# Altium project MiniPC.PrjPcb (part 7 of 10)

## Sheet 12V_POWER.SchDoc: 12V Power PMOS Switches
size B; DocumentNumber: 34; SheetNumber: 34; SheetTotal: 46
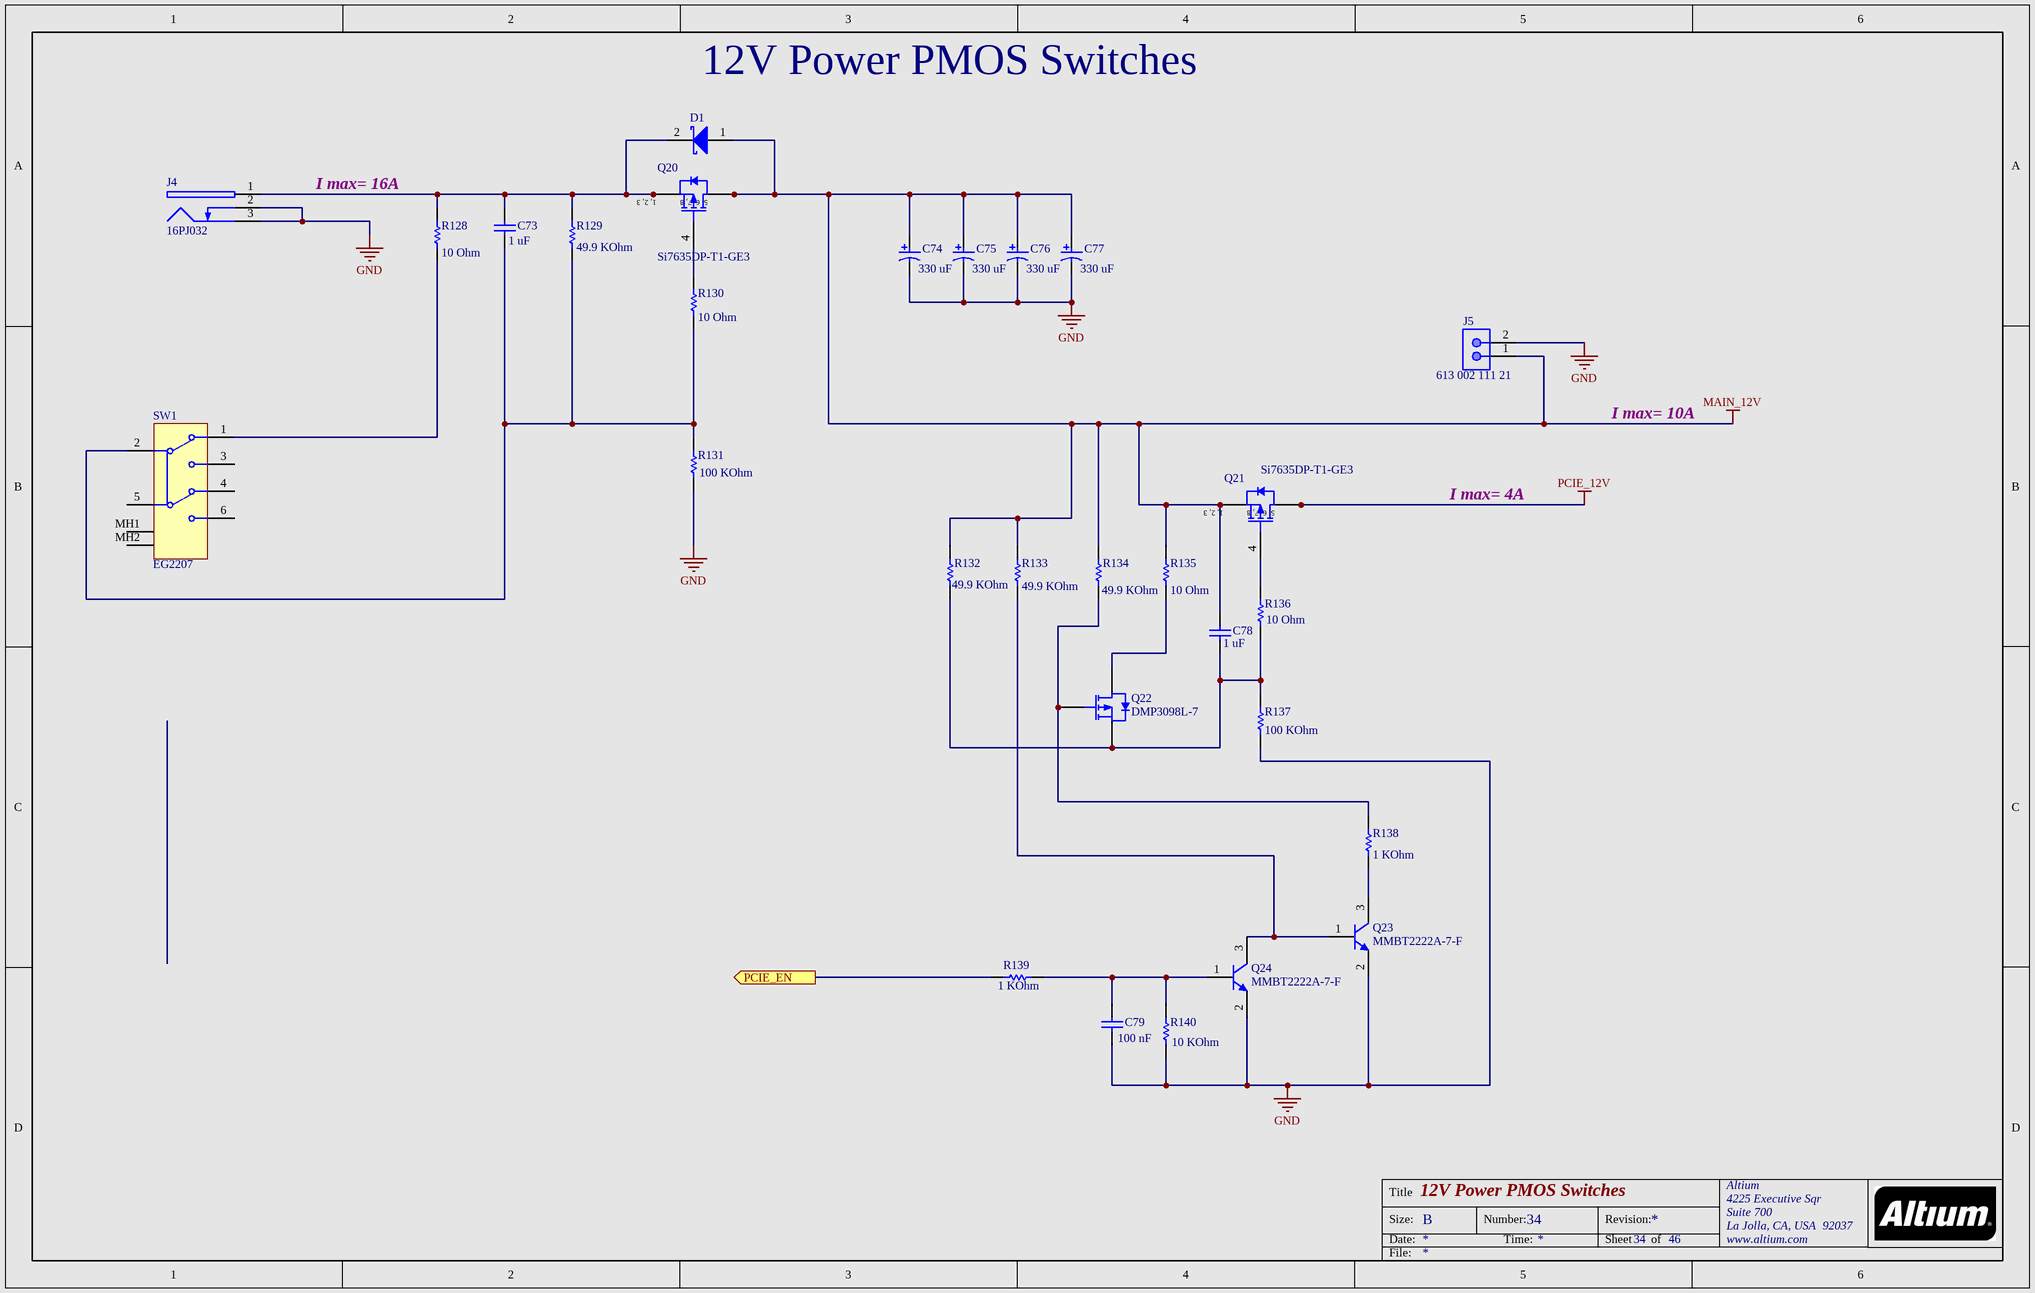
[diagram p22: 12V_POWER.SchDoc]

### Parts
C73  Capacitance: 1 uF  [CAPC1005X33X10LL5]  (hidden comment: CGB2A1X5R1E105K033BC)
C74  Capacitance: 330 uF  [PNSC-EEH-ZA1E331P_M]  (hidden comment: EEH-ZA1E331P)
C75  Capacitance: 330 uF  [PNSC-EEH-ZA1E331P_M]  (hidden comment: EEH-ZA1E331P)
C76  Capacitance: 330 uF  [PNSC-EEH-ZA1E331P_M]  (hidden comment: EEH-ZA1E331P)
C77  Capacitance: 330 uF  [PNSC-EEH-ZA1E331P_M]  (hidden comment: EEH-ZA1E331P)
C78  Capacitance: 1 uF  [CAPC1005X33X10LL5]  (hidden comment: CGB2A1X5R1E105K033BC)
C79  Capacitance: 100 nF  [CAPC1005X55X10LL05]  (hidden comment: C1005X7R1E104M)
D1  B530C-13-F  [DIOD-SMC-2_V]  (value not drawn)
J4  16PJ032  [KOBI-16PJ032_V]
J5  613 002 111 21  [WE-61300211121_V]
Q20  Si7635DP-T1-GE3  [VISH-PPAKSO-8_V]
Q21  Si7635DP-T1-GE3  [VISH-PPAKSO-8_V]
Q22  DMP3098L-7  [DIOD-SOT23-3_V]
Q23  MMBT2222A-7-F  [DIOD-SOT23-3_V]
Q24  MMBT2222A-7-F  [DIOD-SOT23-3_V]
R128  Resistance: 10 Ohm  [RESC1005X40X25LL05T05]  (hidden comment: ERJ-2RKF10R0X)
R129  Resistance: 49.9 KOhm  [RESC1005X40X25LL05T05]  (hidden comment: ERJ-2RKF4992X)
R130  Resistance: 10 Ohm  [RESC1005X40X25LL05T05]  (hidden comment: ERJ-2RKF10R0X)
R131  Resistance: 100 KOhm  [RESC1005X40X25LL05T05]  (hidden comment: ERJ-2RKF1003X)
R132  Resistance: 49.9 KOhm  [RESC1005X40X25LL05T05]  (hidden comment: ERJ-2RKF4992X)
R133  Resistance: 49.9 KOhm  [RESC1005X40X25LL05T05]  (hidden comment: ERJ-2RKF4992X)
R134  Resistance: 49.9 KOhm  [RESC1005X40X25LL05T05]  (hidden comment: ERJ-2RKF4992X)
R135  Resistance: 10 Ohm  [RESC1005X40X25LL05T05]  (hidden comment: ERJ-2RKF10R0X)
R136  Resistance: 10 Ohm  [RESC1005X40X25LL05T05]  (hidden comment: ERJ-2RKF10R0X)
R137  Resistance: 100 KOhm  [RESC1005X40X25LL05T05]  (hidden comment: ERJ-2RKF1003X)
R138  Resistance: 1 KOhm  [RESC1005X40X25LL05T05]  (hidden comment: ERJ-2RKF1001X)
R139  Resistance: 1 KOhm  [RESC1005X40X25LL05T05]  (hidden comment: ERJ-2RKF1001X)
R140  Resistance: 10 KOhm  [RESC1005X40X25NL05T05]  (hidden comment: ERJ-2RKF1002X)
SW1  EG2207  [ESWI-EG2207_V]

### Ports
PCIE_EN (out)

### Nets
GND: C74.2 C75.2 C76.2 C77.2 C79.1 J4.2 J4.3 J5.2 Q23.2(E) Q24.2(E) R131.1 R137.1 R140.1
MAIN_12V: C74.1 C75.1 C76.1 C77.1 C78.2 D1.1(A) J5.1 Q20.5(D) Q20.6(D) Q20.7(D) Q20.8(D) Q21.1(S) Q21.2(S) Q21.3(S) R132.2 R133.2 R134.2 R135.2
PCIE_12V: Q21.5(D) Q21.6(D) Q21.7(D) Q21.8(D)
PCIE_EN: R139.1 ; port PCIE_EN
NetC73_1: C73.1 R129.1 R130.1 R131.2 SW1.2
NetC73_2: C73.2 D1.2(K) J4.1 Q20.1(S) Q20.2(S) Q20.3(S) R128.2 R129.2
NetC78_1: C78.1 Q22.2(S) R132.1 R136.1 R137.2
NetC79_2: C79.2 Q24.1(B) R139.2 R140.2
NetQ20_4: Q20.4(G) R130.2
NetQ21_4: Q21.4(G) R136.2
NetQ22_1: Q22.1(G) R134.1 R138.2
NetQ22_3: Q22.3(D) R135.1
NetQ23_1: Q23.1(B) Q24.3(C) R133.1
NetQ23_3: Q23.3(C) R138.1
NetR128_1: R128.1 SW1.1

Not connected (* = marked no-connect by the designer): SW1 3 4 5 6 MH1 MH2

### Notes on the sheet
- (near R128) I max= 16A
- I max= 10A
- I max= 4A
- Title
- Size:
- Date:
- B
- Number:
- Time:
- Revision:
- Sheet
- of
- File:
- (in symbol CMP-1709-00003-3) 1, 2, 3; 5, 6, 7, 8

### Library data of the parts
C73 C78 = CMP-1663-00006-2: Chip Capacitor, 1 uF, +/- 10%, 25 V, -55 to 85 degC, 0402 (1005 Metric), RoHS, Tape and Reel; Tolerance: 10%; PackageDescription: 2-Pin Surface Mount Device, Body 1 x 0.5 mm; PartNumber: CGB2A1X5R1E105K033BC; Case Code (Metric): 1005; DatasheetVersion: 04/2015; RoHSCompliant: True; Max Operating Temperature: 85 degC; ComponentLink2URL: https://product.tdk.com/info/en/catalog/datasheets/mlcc_commercial_lowprofile_en.pdf; Package Quantity: 1; Width: 0.02 inch; Case/Package: 0402; Case Code (Imperial): 0402; Packaging: Tape and Reel; Length: 0.039 inch; Min Operating Temperature: -55 degC; Mounting Technology: Surface Mount; ComponentLink2Description: Datasheet; ComponentLink1URL: http://www.tdk.com/; ComponentLink1Description: Manufacturer URL
C74-C77 = CMP-1665-00032-1: Aluminum Electrolytic Capacitor, 330 uF, +/- 20%, 25 V, -55 to 105 degC, 2-Pin CAPAE, RoHS, Tape and Reel; Voltage Rating (DC): 25 V; Case\/Package: G; Radiation Hardening: No; DatasheetVersion: 10/2014; ComponentLink1URL: http://www.panasonic.com/; Min Operating Temperature: -55 degC; RoHSCompliant: true; ComponentLink1Description: Manufacturer URL; ComponentLink2Description: Datasheet; Package Quantity: 500; Max Operating Temperature: 105 degC; Mounting Technology: Surface Mount; Mount: Surface Mount; Packaging: Tape and Reel; Tolerance: 20%; Voltage Rating: 25 V; PackageDescription: 2-Pin Aluminum Electrolytic Capacitor, Body 10.2 x 10.2 mm, Diameter 10 mm; PackageReference: EEH-ZA1E331P; REACH SVHC: Unknown; ComponentLink2URL: https://datasheet.ciiva.com/25613/0900766b81233638-25613835.pdf; Length: 10.2 mm; Height: 10.5 mm
C79 = CMP-1663-00009-2: as C483 on sheet PCIE_Connector; Tolerance: 20%; Mounting Technology: Surface Mount; Max Operating Temperature: 125 degC; ComponentLink2URL: http://www.farnell.com/datasheets/1571323.pdf; ComponentLink1URL: http://www.tdk.com/; RoHSCompliant: true; Packaging: Tape and Reel; ComponentLink2Description: Datasheet; Case Code (Imperial): 0402; DatasheetVersion: 09/2011; ComponentLink1Description: Manufacturer URL; PackageDescription: 2-Pin Surface Mount Device, Body 1 x 0.5 mm; PackageReference: 0402; Min Operating Temperature: -55 degC; Case Code (Metric): 1005; Height: 0.5 mm; Package Quantity: 10000; Width: 0.5 mm; Pins: 2; Voltage Rating (DC): 25 V; PartNumber: C1005X7R1E104M; Mount: Surface Mount; Length: 1 mm
D1 = CMP-1693-00001-1: Surface Mount Schottky Barrier Rectifier, 5 A, 0.55 V, -55 to 150 degC, 2-Pin SMD, RoHS, Tape and Reel; Manufacturer: Diodes Inc; PackageReference: SMC-2; Mounting Technology: Surface Mount; DatasheetVersion: Rev. 16-2; ComponentLink2URL: http://www.diodes.com/_files/datasheets/ds13012.pdf; ComponentLink1Description: Manufacturer URL; ComponentLink1URL: http://www.diodes.com/; ComponentLink2Description: Datasheet; PartNumber: B530C-13-F; PackageDescription: 2-Pin Surface Mount Device, Body 5.905 x 6.855 mm
J4 = CMP-1737-00001-1: DC Power Jack, Female, -10 to 70 degC, 3-Pin THD, RoHS; Voltage Rating: 16 V; Current Rating: 1 A; Connector Type: Power; ComponentLink2URL: https://datasheet.ciiva.com/12342/kc-300037-195479-12342832.pdf; Min Operating Temperature: -10 degC; Gender: Female; Package Quantity: 100; PartNumber: 16PJ032; ComponentLink1Description: Manufacturer URL; DatasheetVersion: 05/2009; Mounting Technology: Through Hole; ComponentLink1URL: http://kobiconn.industrialpartner.com/; PackageDescription: 3-Pin Through Hole Device, Body 8.9916 x 13.4874 mm; ComponentLink2Description: Datasheet; RoHSCompliant: false; Max Operating Temperature: 70 degC
J5 = CMP-1712-00002-1: as J18 on sheet PLL; DatasheetVersion: Rev. J; ComponentLink1Description: Manufacturer URL; ComponentLink2URL: http://katalog.we-online.de/em/datasheet/6130xx11121.pdf; PackageReference: 61300211121; ComponentLink2Description: Datasheet; Mounting Technology: Through Hole; PackageDescription: Male Header, Pitch 2.54 mm, 1 x 2 Position, Height 8.54 mm, Tail Length 3 mm; ComponentLink1URL: https://www.we-online.com/; PartNumber: 613 002 111 21
Q20 Q21 = CMP-1709-00003-3: P-Channel MOSFET, 20 V, -55 to 150 degC, 8-Pin SMD (PPAKSO-8), RoHS, Tape and Reel; PartNumber: Si7635DP-T1-GE3; ComponentLink2URL: http://www.vishay.com/docs/65021/si7635dp.pdf; ComponentLink2Description: Datasheet; ComponentLink1URL: http://www.vishay.com/; Mounting Technology: Surface Mount; DatasheetVersion: Rev. B; PackageDescription: 8-Pin Surface Mount Device, Body 4.9 x 5.89 mm, Pitch 1.27 mm; ComponentLink1Description: Manufacturer URL
Q22 = CMP-0697-00001-2: P-Channel Enhancement Mode MOSFET, -30 V VDS, -55 to 155 degC, 3-Pin SOT23, RoHS, Tape and Reel; Manufacturer: Diodes Inc; RDS(on) (Max.) (VGS: 4.5 V)=120 mOhm; VGS(th) (Max.): -2.1 V; PD (TA: 25 degC)=1.08 W; VGS: +/- 20 V; IDS (TA: 25 degC)=-3.8 A; VDS: -30 V; ComponentLink3URL: http://www.diodes.com/datasheets/ap02002.pdf; Operating Temperature Range: -55 to 150 degC; Packing: Tape and Reel; ComponentLink2Description: Datasheet; PackageVersion: Rev. 75; ComponentLink1URL: http://www.diodes.com/; RoHS: TRUE; DatasheetVersion: Rev. 8 - 2; PackageDescription: 3-Pin Small Outline Transistor, Body 1.3 x 2.9 mm, Pitch 0.95 mm; ComponentLink2URL: http://www.diodes.com/datasheets/ds31447.pdf; PackageReference: SOT23; ComponentLink3Description: Package Specification; PartNumber: DMP3098L-7; ComponentLink1Description: Manufacturer URL; Mounting Technology: Surface Mount
Q23 Q24 = CMP-1693-00003-1: NPN Small Signal Transistor, 40 V, -55 to 150 degC, 3-Pin SOT23, RoHS, Tape and Reel; Manufacturer: Diodes Inc; ComponentLink1URL: http://www.diodes.com/; ComponentLink2Description: Datasheet; PackageReference: SOT23-3; PartNumber: MMBT2222A-7-F; ComponentLink1Description: Manufacturer URL; ComponentLink2URL: http://www.diodes.com/_files/datasheets/ds30041.pdf; PackageDescription: 3-Pin Small Outline Transistor, Body 2.9 x 1.3 mm, Pitch 0.95 mm; DatasheetVersion: Rev. 16 - 2; Mounting Technology: Surface Mount
R128 R130 R135 R136 = CMP-2002-00622-3: Chip Resistor, 10 Ohm, +/- 1%, 100 mW, -55 to 155 degC, 0402 (1005 Metric), RoHS, Tape and Reel; Manufacturer: Basic Passives; Voltage Rating: 50 V; Power Rating: 100 mW; Case\/Package: 0402; RoHSCompliant: true; PartNumber: ERJ-2RKF10R0X; Case Code (Imperial): 0402; Package Quantity: 10000; ComponentLink1Description: Manufacturer URL; Width: 0.5 mm; Height: 0.35 mm; Tolerance: 1%; REACH SVHC: Yes; Case Code (Metric): 1005; Max Operating Temperature: 155 degC; PackageDescription: 2-Pin Surface Mount Device, Body 1 x 0.5 mm; Mounting Technology: Surface Mount; Min Operating Temperature: -55 degC; Mount: Surface Mount; Packaging: Tape and Reel; ComponentLink1URL: http://www.panasonic.com/; Length: 1 mm; ComponentLink2Description: Datasheet; Pins: 2; PackageReference: 0402; Radiation Hardening: No; ComponentLink2URL: http://industrial.panasonic.com/cdbs/www-data/pdf/RDA0000/AOA0000C86.pdf; DatasheetVersion: 04/2015
R129 R132-R134 = CMP-2002-00967-3: Chip Resistor, 49.9 KOhm, +/- 1%, 100 mW, -55 to 155 degC, 0402 (1005 Metric), RoHS, Tape and Reel; Manufacturer: Basic Passives; Voltage Rating: 50 V; Power Rating: 100 mW; Case\/Package: 0402; Case Code (Metric): 1005; Case Code (Imperial): 0402; Min Operating Temperature: -55 degC; Length: 1 mm; Height: 0.35 mm; ComponentLink1URL: http://www.panasonic.com/; PackageDescription: 2-Pin Surface Mount Device, Body 1 x 0.5 mm; PartNumber: ERJ-2RKF4992X; RoHSCompliant: true; Tolerance: 1%; Width: 0.5 mm; ComponentLink1Description: Manufacturer URL; Package Quantity: 10000; Packaging: Tape and Reel; REACH SVHC: No SVHC; Mount: Surface Mount; Mounting Technology: Surface Mount; Max Operating Temperature: 155 degC; Pins: 2; DatasheetVersion: 04/2015; ComponentLink2URL: http://industrial.panasonic.com/cdbs/www-data/pdf/RDA0000/AOA0000C86.pdf; Radiation Hardening: No; PackageReference: 0402; ComponentLink2Description: Datasheet
R131 R137 = CMP-2002-00608-3: Chip Resistor, 100 KOhm, +/- 1%, 100 mW, -55 to 155 degC, 0402 (1005 Metric), RoHS, Tape and Reel; Manufacturer: Basic Passives; Voltage Rating: 50 V; Power Rating: 100 mW; Case\/Package: 0402; Height: 0.35 mm; ComponentLink1Description: Manufacturer URL; Packaging: Tape and Reel; Min Operating Temperature: -55 degC; RoHSCompliant: true; PackageDescription: 2-Pin Surface Mount Device, Body 1 x 0.5 mm; Mount: Surface Mount; Package Quantity: 10000; Max Operating Temperature: 155 degC; ComponentLink1URL: http://www.panasonic.com/; Tolerance: 1%; Mounting Technology: Surface Mount; PartNumber: ERJ-2RKF1003X; Case Code (Metric): 1005; Case Code (Imperial): 0402; REACH SVHC: Yes; Length: 1 mm; Width: 0.5 mm; DatasheetVersion: 04/2015; Pins: 2; ComponentLink2Description: Datasheet; ComponentLink2URL: http://industrial.panasonic.com/cdbs/www-data/pdf/RDA0000/AOA0000C86.pdf; PackageReference: 0402; Radiation Hardening: No
R138 R139 = CMP-2002-00606-3: as R339-R341 on sheet PLL; PartNumber: ERJ-2RKF1001X; Width: 0.5 mm; ComponentLink1URL: http://www.panasonic.com/; Length: 1 mm; Min Operating Temperature: -55 degC; PackageDescription: 2-Pin Surface Mount Device, Body 1 x 0.5 mm; Case Code (Metric): 1005; Height: 0.35 mm; ComponentLink1Description: Manufacturer URL; Mounting Technology: Surface Mount; Tolerance: 1%; Packaging: Tape and Reel; Package Quantity: 10000; REACH SVHC: Yes; Max Operating Temperature: 155 degC; Mount: Surface Mount; RoHSCompliant: true; Case Code (Imperial): 0402; DatasheetVersion: 04/2015; Radiation Hardening: No; Pins: 2; ComponentLink2Description: Datasheet; PackageReference: 0402; ComponentLink2URL: http://industrial.panasonic.com/cdbs/www-data/pdf/RDA0000/AOA0000C86.pdf
R140 = CMP-2002-00607-3: Chip Resistor, 10 KOhm, +/- 1%, 100 mW, -55 to 155 degC, 0402 (1005 Metric), RoHS, Tape and Reel; Manufacturer: Basic Passives; Voltage Rating: 50 V; Power Rating: 100 mW; Case\/Package: 0402; Case Code (Imperial): 0402; Min Operating Temperature: -55 degC; PartNumber: ERJ-2RKF1002X; Mounting Technology: Surface Mount; Length: 1 mm; Packaging: Tape and Reel; ComponentLink1Description: Manufacturer URL; Mount: Surface Mount; Package Quantity: 10000; Max Operating Temperature: 155 degC; Case Code (Metric): 1005; Height: 0.35 mm; ComponentLink1URL: http://www.panasonic.com/; Tolerance: 1%; REACH SVHC: Yes; RoHSCompliant: true; Width: 0.5 mm; PackageDescription: 2-Pin Surface Mount Device, Body 1 x 0.5 mm; Radiation Hardening: No; PackageReference: 0402; ComponentLink2Description: Datasheet; DatasheetVersion: 04/2015; ComponentLink2URL: http://industrial.panasonic.com/cdbs/www-data/pdf/RDA0000/AOA0000C86.pdf; Pins: 2
SW1 = CMP-1696-00001-3: Slide Switch DPDT, 30 V, -20 to 70 degC, 6-Pin THD, RoHS, Bulk; ComponentLink1URL: http://www.e-switch.ch/en/; ComponentLink2URL: https://datasheet.ciiva.com/16174/p040100-16174286.pdf; PartNumber: EG2207; ComponentLink2Description: Datasheet; ComponentLink1Description: Manufacturer URL; PackageDescription: 6-Pin Throung Hole Device, Body 10 x 6 mm, Pitch 2 mm; DatasheetVersion: Rev. E; Mounting Technology: Through Hole; Width: 6 mm; RoHSCompliant: True; Packaging: Bulk; REACH SVHC: No SVHC; Max Operating Temperature: 70 degC; Length: 10 mm; Package Quantity: 1000; Height: 7.7 mm; Mount: Through Hole; Min Operating Temperature: -20 degC

## Sheet 12V_3V3_1V8_Swiches.SchDoc: A10 12V,3V3 and 1V8 PMOS Switches
size B; DocumentNumber: 33; SheetNumber: 33; SheetTotal: 46
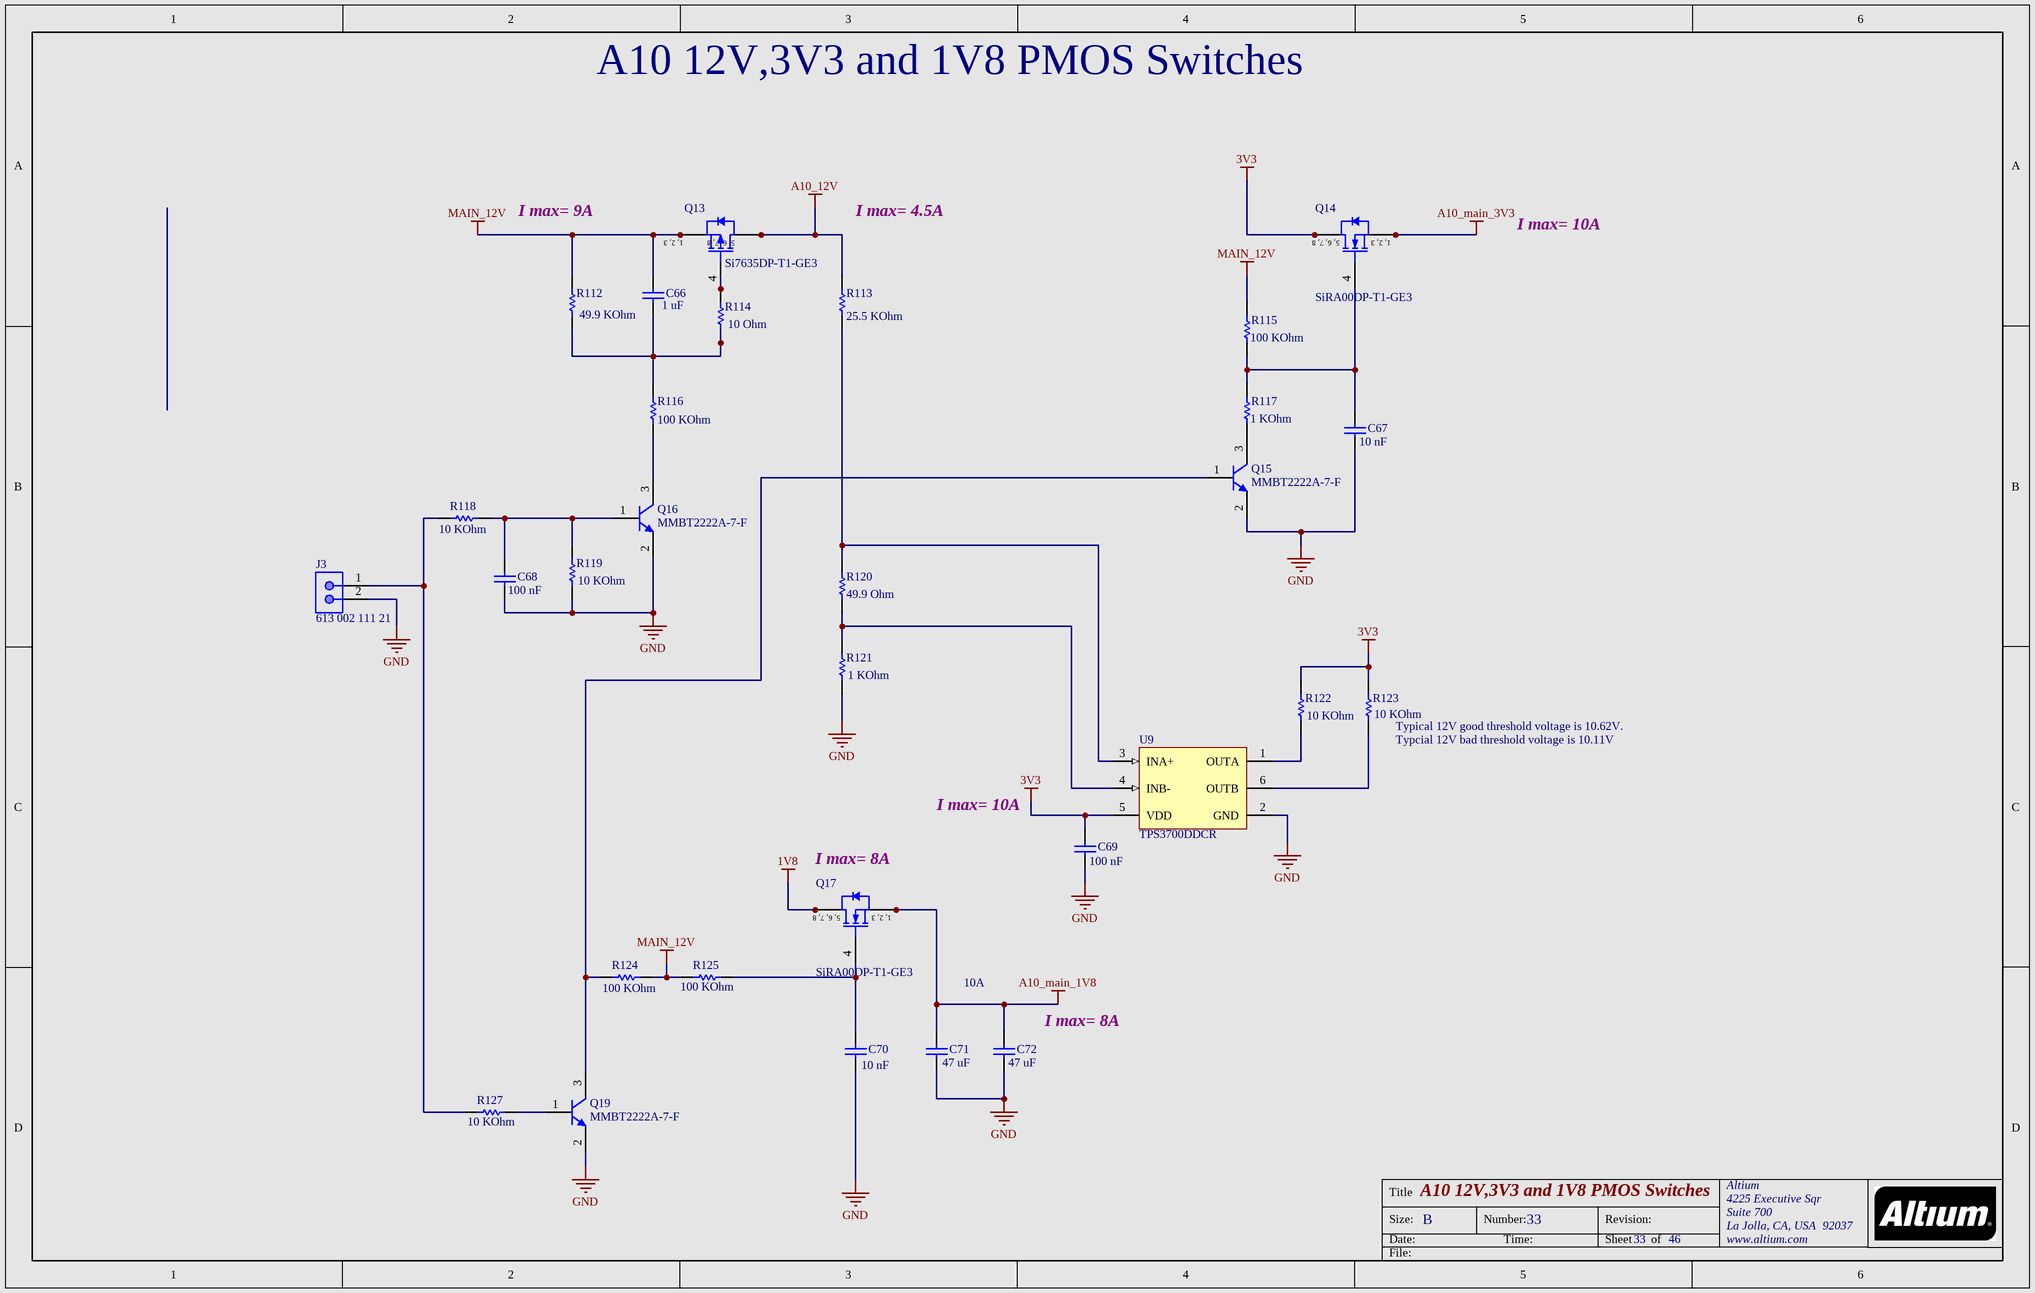
[diagram p23: 12V_3V3_1V8_Swiches.SchDoc]

### Parts
C66  Capacitance: 1 uF  [CAPC1005X33X10LL5]  (hidden comment: CGB2A1X5R1E105K033BC)
C67  Capacitance: 10 nF  [CAPC1005X55X25ML05T10]  (hidden comment: GRM155R71H103KA88D)
C68  Capacitance: 100 nF  [CAPC1005X55X10LL05]  (hidden comment: C1005X7R1E104M)
C69  Capacitance: 100 nF  [CAPC1005X55X10LL05]  (hidden comment: C1005X7R1E104M)
C70  Capacitance: 10 nF  [CAPC1005X55X25ML05T10]  (hidden comment: GRM155R71H103KA88D)
C71  Capacitance: 47 uF  [CAPC3216X180X20ML20]  (hidden comment: C3216X5R1A476M160AB)
C72  Capacitance: 47 uF  [CAPC3216X180X20ML20]  (hidden comment: C3216X5R1A476M160AB)
J3  613 002 111 21  [WE-61300211121_V]
Q13  Si7635DP-T1-GE3  [VISH-PPAKSO-8_V]
Q14  SiRA00DP-T1-GE3  [VISH-PPAKSO-8_V]
Q15  MMBT2222A-7-F  [DIOD-SOT23-3_V]
Q16  MMBT2222A-7-F  [DIOD-SOT23-3_V]
Q17  SiRA00DP-T1-GE3  [VISH-PPAKSO-8_V]
Q19  MMBT2222A-7-F  [DIOD-SOT23-3_V]
R112  Resistance: 49.9 KOhm  [RESC1005X40X25ML05T05]  (hidden comment: CMP-2002-00967)
R113  Resistance: 25.5 KOhm  [RESC1005X40X25NL05T05]  (hidden comment: ERJ-2RKF2552x)
R114  Resistance: 10 Ohm  [RESC1005X40X25LL05T05]  (hidden comment: ERJ-2RKF10R0X)
R115  Resistance: 100 KOhm  [RESC1005X40X25LL05T05]  (hidden comment: ERJ-2RKF1003X)
R116  Resistance: 100 KOhm  [RESC1005X40X25LL05T05]  (hidden comment: ERJ-2RKF1003X)
R117  Resistance: 1 KOhm  [RESC1005X40X25LL05T05]  (hidden comment: ERJ-2RKF1001X)
R118  Resistance: 10 KOhm  [RESC1005X40X25NL05T05]  (hidden comment: ERJ-2RKF1002X)
R119  Resistance: 10 KOhm  [RESC1005X40X25NL05T05]  (hidden comment: ERJ-2RKF1002X)
R120  Resistance: 49.9 Ohm  [RESC1005X35X25NL8T10]  (hidden comment: NRC04F49R9TRF)
R121  Resistance: 1 KOhm  [RESC1005X40X25LL05T05]  (hidden comment: ERJ-2RKF1001X)
R122  Resistance: 10 KOhm  [RESC1005X40X25NL05T05]  (hidden comment: ERJ-2RKF1002X)
R123  Resistance: 10 KOhm  [RESC1005X40X25NL05T05]  (hidden comment: ERJ-2RKF1002X)
R124  Resistance: 100 KOhm  [RESC1005X40X25LL05T05]  (hidden comment: ERJ-2RKF1003X)
R125  Resistance: 100 KOhm  [RESC1005X40X25LL05T05]  (hidden comment: ERJ-2RKF1003X)
R127  Resistance: 10 KOhm  [RESC1005X40X25NL05T05]  (hidden comment: ERJ-2RKF1002X)
U9  TPS3700DDCR  [DDC0006A_M]

### Nets
1V8: Q17.5(D) Q17.6(D) Q17.7(D) Q17.8(D)
3V3: C69.2 Q14.5(D) Q14.6(D) Q14.7(D) Q14.8(D) R122.1 R123.1 U9.5(VDD)
A10_12V: Q13.5(D) Q13.6(D) Q13.7(D) Q13.8(D) R113.2
A10_main_1V8: C71.2 C72.2 Q17.1(S) Q17.2(S) Q17.3(S)
A10_main_3V3: Q14.1(S) Q14.2(S) Q14.3(S)
GND: C67.1 C68.1 C69.1 C70.1 C71.1 C72.1 J3.2 Q15.2(E) Q16.2(E) Q19.2(E) R119.1 R121.1 U9.2(GND)
MAIN_12V: C66.2 Q13.1(S) Q13.2(S) Q13.3(S) R112.2 R115.2 R124.1 R125.2
NetC66_1: C66.1 R112.1 R114.1 R116.2
NetC67_2: C67.2 Q14.4(G) R115.1 R117.2
NetC68_2: C68.2 Q16.1(B) R118.1 R119.2
NetC70_2: C70.2 Q17.4(G) R125.1
NetJ3_1: J3.1 R118.2 R127.2
NetQ13_4: Q13.4(G) R114.2
NetQ15_1: Q15.1(B) Q19.3(C) R124.2
NetQ15_3: Q15.3(C) R117.1
NetQ16_3: Q16.3(C) R116.1
NetQ19_1: Q19.1(B) R127.1
NetR113_1: R113.1 R120.2 U9.3(INA+)
NetR120_1: R120.1 R121.2 U9.4(INB-)
NetR122_2: R122.2 U9.1(OUTA)
NetR123_2: R123.2 U9.6(OUTB)

### Notes on the sheet
- I max= 9A
- I max= 4.5A
- I max= 10A
- (near R123) Typical 12V good threshold voltage is 10.62V.
- (near R123) Typcial 12V bad threshold voltage is 10.11V
- (near Q17) I max= 8A
- 10A
- (near C72) I max= 8A
- Title
- Size:
- Date:
- B
- Number:
- Time:
- Revision:
- Sheet
- of
- File:
- (in symbol CMP-1709-00003-3) 1, 2, 3; 5, 6, 7, 8
- (in symbol CMP-1709-00004-3) 5, 6, 7, 8; 1, 2, 3

### Library data of the parts
C66 = CMP-1663-00006-2: as C73 on sheet 12V_POWER; Tolerance: 10%; PackageDescription: 2-Pin Surface Mount Device, Body 1 x 0.5 mm; PartNumber: CGB2A1X5R1E105K033BC; Case Code (Metric): 1005; DatasheetVersion: 04/2015; RoHSCompliant: True; Max Operating Temperature: 85 degC; ComponentLink2URL: https://product.tdk.com/info/en/catalog/datasheets/mlcc_commercial_lowprofile_en.pdf; Package Quantity: 1; Width: 0.02 inch; Case/Package: 0402; Case Code (Imperial): 0402; Packaging: Tape and Reel; Length: 0.039 inch; Min Operating Temperature: -55 degC; Mounting Technology: Surface Mount; ComponentLink2Description: Datasheet; ComponentLink1URL: http://www.tdk.com/; ComponentLink1Description: Manufacturer URL
C67 C70 = CMP-2008-04637-4: as C543 on sheet PLL; Mounting Technology: Surface Mount; Max Operating Temperature: 125 degC; Height: 0.5 mm; PackageDescription: 2-Pin Surface Mount Device, Body 1 x 0.5 mm; Case Code (Imperial): 0402; Tolerance: 10%; ComponentLink1URL: http://www.murata.com/; RoHSCompliant: true; Width: 0.5 mm; Package Quantity: 10000; Packaging: Tape and Reel; ComponentLink1Description: Manufacturer URL; Min Operating Temperature: -55 degC; PartNumber: GRM155R71H103KA88D; REACH SVHC: No SVHC; Case Code (Metric): 1005; Length: 1 mm; DatasheetVersion: 02/2016; Mount: Surface Mount; Radiation Hardening: No; Lead Pitch: 2mm; Voltage Rating (DC): 50 V; Pins: 2; ComponentLink2URL: http://search.murata.co.jp/Ceramy/image/img/A01X/G101/ENG/GRM155R71H103KA88-01.pdf; ComponentLink2Description: Datasheet; PackageReference: 0402
C68 C69 = CMP-1663-00009-2: as C483 on sheet PCIE_Connector; Tolerance: 20%; Mounting Technology: Surface Mount; Max Operating Temperature: 125 degC; ComponentLink2URL: http://www.farnell.com/datasheets/1571323.pdf; ComponentLink1URL: http://www.tdk.com/; RoHSCompliant: true; Packaging: Tape and Reel; ComponentLink2Description: Datasheet; Case Code (Imperial): 0402; DatasheetVersion: 09/2011; ComponentLink1Description: Manufacturer URL; PackageDescription: 2-Pin Surface Mount Device, Body 1 x 0.5 mm; PackageReference: 0402; Min Operating Temperature: -55 degC; Case Code (Metric): 1005; Height: 0.5 mm; Package Quantity: 10000; Width: 0.5 mm; Pins: 2; Voltage Rating (DC): 25 V; PartNumber: C1005X7R1E104M; Mount: Surface Mount; Length: 1 mm
C71 C72 = CMP-1663-00005-1: Chip Capacitor, 47 uF, +/- 20%, 10 V, -55 to 85 degC, 1206 (3216 Metric), RoHS, Tape and Reel; Voltage Rating (DC): 10 V; Type (Capacitors): X5R; Case\/Package: 1206; Tolerance: 20%; Voltage Rating: 10 V; Packaging: Tape and Reel; ComponentLink2URL: https://product.tdk.com/info/en/catalog/datasheets/mlcc_commercial_general_en.pdf; Min Operating Temperature: -55 degC; Length: 3.2 mm; Radiation Hardening: No; Mounting Technology: Surface Mount; PackageDescription: 2-Pin Surface Mount Device, Body 3.2 x 1.6 mm; Max Operating Temperature: 85 degC; Case Code (Metric): 3216; ComponentLink1URL: http://www.tdk.com/; DatasheetVersion: 03/2015; Mount: Surface Mount; Case Code (Imperial): 1206; Package Quantity: 2000; ComponentLink2Description: Datasheet; PackageReference: 3216; Height: 1.6 mm; RoHSCompliant: true; Width: 1.6 mm; ComponentLink1Description: Manufacturer URL
J3 = CMP-1712-00002-1: as J18 on sheet PLL; DatasheetVersion: Rev. J; ComponentLink1Description: Manufacturer URL; ComponentLink2URL: http://katalog.we-online.de/em/datasheet/6130xx11121.pdf; PackageReference: 61300211121; ComponentLink2Description: Datasheet; Mounting Technology: Through Hole; PackageDescription: Male Header, Pitch 2.54 mm, 1 x 2 Position, Height 8.54 mm, Tail Length 3 mm; ComponentLink1URL: https://www.we-online.com/; PartNumber: 613 002 111 21
Q13 = CMP-1709-00003-3: as Q20 on sheet 12V_POWER; PartNumber: Si7635DP-T1-GE3; ComponentLink2URL: http://www.vishay.com/docs/65021/si7635dp.pdf; ComponentLink2Description: Datasheet; ComponentLink1URL: http://www.vishay.com/; Mounting Technology: Surface Mount; DatasheetVersion: Rev. B; PackageDescription: 8-Pin Surface Mount Device, Body 4.9 x 5.89 mm, Pitch 1.27 mm; ComponentLink1Description: Manufacturer URL
Q14 Q17 = CMP-1709-00004-3: N-Channe MOSFET, 30 V, -55 to 150 degC, 8-Pin SMD (PPAKSO-8), RoHS, Tape and Reel; PartNumber: SiRA00DP-T1-GE3; ComponentLink1Description: Manufacturer URL; ComponentLink1URL: http://www.vishay.com/; ComponentLink2URL: http://www.vishay.com/docs/63780/sira00dp.pdf; DatasheetVersion: Rev. B; Mounting Technology: Surface Mount; ComponentLink2Description: Datasheet; PackageDescription: 8-Pin Surface Mount Device, Body 4.9 x 5.89 mm, Pitch 1.27 mm; Width: 5 mm; Mount: Surface Mount; Packaging: Tape and Reel; RoHSCompliant: True; Radiation Hardening: No; Min Operating Temperature: -55 degC; REACH SVHC: Unknown; Max Operating Temperature: 150 degC; Case/Package: SOIC; Package Quantity: 1; Length: 5.99 mm; Height: 1.07 mm; Pins: 8
Q15 Q16 Q19 = CMP-1693-00003-1: as Q23 on sheet 12V_POWER; ComponentLink1URL: http://www.diodes.com/; ComponentLink2Description: Datasheet; PackageReference: SOT23-3; PartNumber: MMBT2222A-7-F; ComponentLink1Description: Manufacturer URL; ComponentLink2URL: http://www.diodes.com/_files/datasheets/ds30041.pdf; PackageDescription: 3-Pin Small Outline Transistor, Body 2.9 x 1.3 mm, Pitch 0.95 mm; DatasheetVersion: Rev. 16 - 2; Mounting Technology: Surface Mount
R112 = CMP-2002-00967-2: Chip Resistor, 49.9 KOhm, +/- 1%, 100 mW, -55 to 155 degC, 0402 (1005 Metric), RoHS, Tape and Reel; PartNumber: ERJ-2RKF4992X; Voltage Rating: 50 V; Power Rating: 100 mW; Case Code (Metric): 1005; Case Code (Imperial): 0402; Min Operating Temperature: -55 degC; Length: 1 mm; Height: 0.35 mm; ComponentLink1URL: http://industrial.panasonic.com/cdbs/www-data/pdf/RDA0000/AOA0000C86.pdf; PackageDescription: 2-Pin Surface Mount Device, Body 1 x 0.5 mm; Case/Package: 0402; RoHSCompliant: True; Tolerance: 1%; Width: 0.5 mm; ComponentLink1Description: Datasheet; Package Quantity: 10000; Packaging: Tape and Reel; REACH SVHC: No SVHC; Mount: Surface Mount; Mounting Technology: Surface Mount; Max Operating Temperature: 155 degC
R113 = CMP-2002-00813-3: Chip Resistor, 25.5 KOhm, +/- 1%, 100 mW, -55 to 155 degC, 0402 (1005 Metric), RoHS, Tape and Reel; Voltage Rating: 50 V; Power Rating: 100 mW; RoHSCompliant: True; PartNumber: ERJ-2RKF2552x; Case Code (Imperial): 0402; Package Quantity: 1; ComponentLink1Description: Datasheet; Width: 0.5 mm; Height: 0.35 mm; Tolerance: 1%; REACH SVHC: Yes; Case Code (Metric): 1005; Max Operating Temperature: 155 degC; PackageDescription: 2-Pin Surface Mount Device, Body 1 x 0.5 mm; Mounting Technology: Surface Mount; Min Operating Temperature: -55 degC; Case/Package: 0402; Mount: Surface Mount; Packaging: Tape and Reel; ComponentLink1URL: http://industrial.panasonic.com/cdbs/www-data/pdf/RDA0000/AOA0000C86.pdf; Length: 1 mm
R114 = CMP-2002-00622-3: as R128 on sheet 12V_POWER; RoHSCompliant: true; PartNumber: ERJ-2RKF10R0X; Case Code (Imperial): 0402; Package Quantity: 10000; ComponentLink1Description: Manufacturer URL; Width: 0.5 mm; Height: 0.35 mm; Tolerance: 1%; REACH SVHC: Yes; Case Code (Metric): 1005; Max Operating Temperature: 155 degC; PackageDescription: 2-Pin Surface Mount Device, Body 1 x 0.5 mm; Mounting Technology: Surface Mount; Min Operating Temperature: -55 degC; Mount: Surface Mount; Packaging: Tape and Reel; ComponentLink1URL: http://www.panasonic.com/; Length: 1 mm; ComponentLink2Description: Datasheet; Pins: 2; PackageReference: 0402; Radiation Hardening: No; ComponentLink2URL: http://industrial.panasonic.com/cdbs/www-data/pdf/RDA0000/AOA0000C86.pdf; DatasheetVersion: 04/2015
R115 R116 R124 R125 = CMP-2002-00608-3: as R131 on sheet 12V_POWER; Height: 0.35 mm; ComponentLink1Description: Manufacturer URL; Packaging: Tape and Reel; Min Operating Temperature: -55 degC; RoHSCompliant: true; PackageDescription: 2-Pin Surface Mount Device, Body 1 x 0.5 mm; Mount: Surface Mount; Package Quantity: 10000; Max Operating Temperature: 155 degC; ComponentLink1URL: http://www.panasonic.com/; Tolerance: 1%; Mounting Technology: Surface Mount; PartNumber: ERJ-2RKF1003X; Case Code (Metric): 1005; Case Code (Imperial): 0402; REACH SVHC: Yes; Length: 1 mm; Width: 0.5 mm; DatasheetVersion: 04/2015; Pins: 2; ComponentLink2Description: Datasheet; ComponentLink2URL: http://industrial.panasonic.com/cdbs/www-data/pdf/RDA0000/AOA0000C86.pdf; PackageReference: 0402; Radiation Hardening: No
R117 R121 = CMP-2002-00606-3: as R339-R341 on sheet PLL; PartNumber: ERJ-2RKF1001X; Width: 0.5 mm; ComponentLink1URL: http://www.panasonic.com/; Length: 1 mm; Min Operating Temperature: -55 degC; PackageDescription: 2-Pin Surface Mount Device, Body 1 x 0.5 mm; Case Code (Metric): 1005; Height: 0.35 mm; ComponentLink1Description: Manufacturer URL; Mounting Technology: Surface Mount; Tolerance: 1%; Packaging: Tape and Reel; Package Quantity: 10000; REACH SVHC: Yes; Max Operating Temperature: 155 degC; Mount: Surface Mount; RoHSCompliant: true; Case Code (Imperial): 0402; DatasheetVersion: 04/2015; Radiation Hardening: No; Pins: 2; ComponentLink2Description: Datasheet; PackageReference: 0402; ComponentLink2URL: http://industrial.panasonic.com/cdbs/www-data/pdf/RDA0000/AOA0000C86.pdf
R118 R119 R122 R123 R127 = CMP-2002-00607-3: as R140 on sheet 12V_POWER; Case Code (Imperial): 0402; Min Operating Temperature: -55 degC; PartNumber: ERJ-2RKF1002X; Mounting Technology: Surface Mount; Length: 1 mm; Packaging: Tape and Reel; ComponentLink1Description: Manufacturer URL; Mount: Surface Mount; Package Quantity: 10000; Max Operating Temperature: 155 degC; Case Code (Metric): 1005; Height: 0.35 mm; ComponentLink1URL: http://www.panasonic.com/; Tolerance: 1%; REACH SVHC: Yes; RoHSCompliant: true; Width: 0.5 mm; PackageDescription: 2-Pin Surface Mount Device, Body 1 x 0.5 mm; Radiation Hardening: No; PackageReference: 0402; ComponentLink2Description: Datasheet; DatasheetVersion: 04/2015; ComponentLink2URL: http://industrial.panasonic.com/cdbs/www-data/pdf/RDA0000/AOA0000C86.pdf; Pins: 2
R120 = CMP-1599-00001-2: Chip Resistor, 49.9 Ohm, +/- 1%, 0.06 W, -55 to 155 degC, 0402 (1005 Metric), RoHS, Tape and Reel; Min Operating Temperature: -55 degC; Length: 1 mm; Height: 0.3 mm; ComponentLink1URL: http://www.niccomp.com/; PackageDescription: 2-Pin Surface Mount Device, Body 1 x 0.5 mm; PartNumber: NRC04F49R9TRF; Case/Package: 0402; RoHSCompliant: True; Tolerance: 1%; ComponentLink1Description: Manufacturer URL; Packaging: Tape and Reel; Mounting Technology: Surface Mount; Max Operating Temperature: 155 degC; ComponentLink2Description: Datasheet; DatasheetVersion: 11/2008; Radiation Hardening: No; ComponentLink2URL: https://datasheet.ciiva.com/27056/2008575-27056094.pdf
U9 = CMP-1708-00001-4: Window Comparator with Internal Reference for Overvoltage and Undervoltage Detection, 1.8 to 18 V, -40 to 125 degC, 6-Pin SOT (DDC), Green (RoHS & no Sb/Br), Tape and Reel; Max Supply Voltage: 18 V; Min Supply Voltage: 1.8 V; PartNumber: TPS3700DDCR; ComponentLink3URL: http://www.ti.com/litv/pdf/mpds124d; ComponentLink1Description: Manufacturer URL; ComponentLink2Description: Datasheet; ComponentLink2URL: http://www.ti.com/lit/ds/symlink/tps3700.pdf; PackageVersion: 4204403-3/E, 06/2005; ComponentLink1URL: http://www.ti.com/; ComponentLink3Description: Package Specification; PackageDescription: 6-Pin Small Outline Transistor, Body 2.9 x 1.6 mm, Pitch 0.95 mm; DatasheetVersion: SBVS187D; Mounting Technology: Surface Mount; Code_JEDEC: MO-193; RoHSCompliant: True; Case/Package: SOT-6; Package Quantity: 3000; Pins: 6; Min Operating Temperature: -40 degC; Mount: Surface Mount; Packaging: Tape and Reel; Max Operating Temperature: 125 degC

## Sheet 12V_to_0V9.SchDoc: 12V to 0V9 Converter
size B; DocumentNumber: 35; SheetNumber: 35; SheetTotal: 46
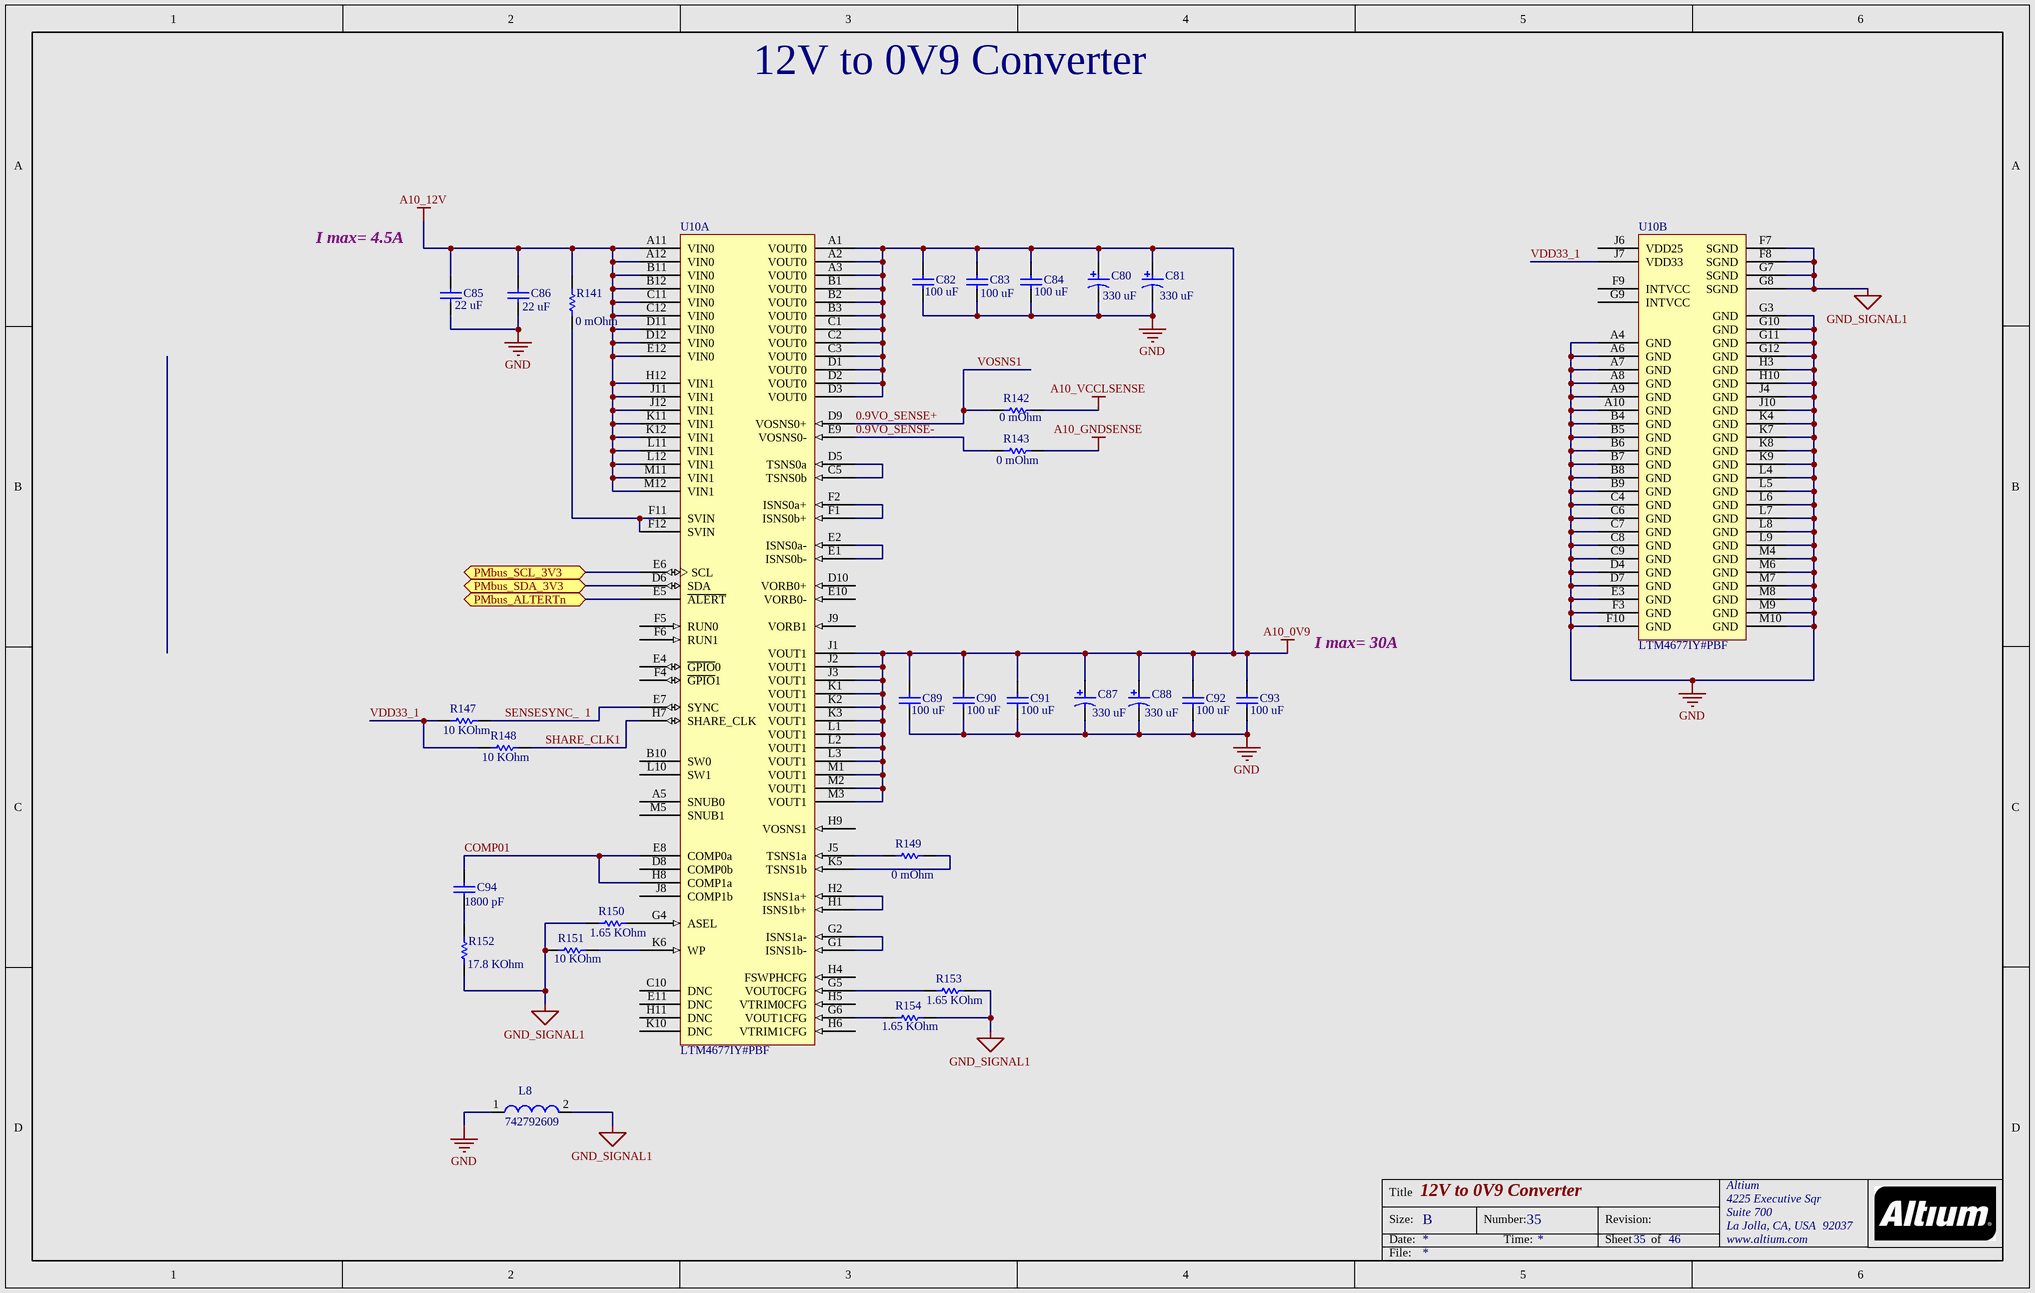
[diagram p24: 12V_to_0V9.SchDoc]

### Parts
(Parts that share a designator on the sheet are numbered #1, #2 ... from top to bottom, then left to right.)
C80  Capacitance: 330 uF  [PNSC-TPF-D3L_V]  (hidden comment: 6TPF330M9L)
C81  Capacitance: 330 uF  [PNSC-TPF-D3L_V]  (hidden comment: 6TPF330M9L)
C82  Capacitance: 100 uF  [CAPC3216X190X55ML30T25]  (hidden comment: GRM31CR60J107ME39L)
C83  Capacitance: 100 uF  [CAPC3216X190X55ML30T25]  (hidden comment: GRM31CR60J107ME39L)
C84  Capacitance: 100 uF  [CAPC3216X190X55ML30T25]  (hidden comment: GRM31CR60J107ME39L)
C85  Capacitance: 22 uF  [CAPC3216X180X55ML20T25]  (hidden comment: GRM31CR61E226KE15L)
C86  Capacitance: 22 uF  [CAPC3216X180X55ML20T25]  (hidden comment: GRM31CR61E226KE15L)
C87  Capacitance: 330 uF  [PNSC-TPF-D3L_V]  (hidden comment: 6TPF330M9L)
C88  Capacitance: 330 uF  [PNSC-TPF-D3L_V]  (hidden comment: 6TPF330M9L)
C89  Capacitance: 100 uF  [CAPC3216X190X55ML30T25]  (hidden comment: GRM31CR60J107ME39L)
C90  Capacitance: 100 uF  [CAPC3216X190X55ML30T25]  (hidden comment: GRM31CR60J107ME39L)
C91  Capacitance: 100 uF  [CAPC3216X190X55ML30T25]  (hidden comment: GRM31CR60J107ME39L)
C92  Capacitance: 100 uF  [CAPC3216X190X55ML30T25]  (hidden comment: GRM31CR60J107ME39L)
C93  Capacitance: 100 uF  [CAPC3216X190X55ML30T25]  (hidden comment: GRM31CR60J107ME39L)
C94  Capacitance: 1800 pF  [CAPC1005X55X23NL05T8]  (hidden comment: VJ0402Y182JXJCW1BC)
L8  742792609  [SMD-0603]
R141  Resistance: 0 mOhm  [RESC1005X40X25ML05T05]  (hidden comment: ERJ-2GE0R00X)
R142  Resistance: 0 mOhm  [RESC1005X40X25ML05T05]  (hidden comment: ERJ-2GE0R00X)
R143  Resistance: 0 mOhm  [RESC1005X40X25ML05T05]  (hidden comment: ERJ-2GE0R00X)
R147  Resistance: 10 KOhm  [RESC1005X40X25NL05T05]  (hidden comment: ERJ-2RKF1002X)
R148  Resistance: 10 KOhm  [RESC1005X40X25NL05T05]  (hidden comment: ERJ-2RKF1002X)
R149  Resistance: 0 mOhm  [RESC1005X40X25ML05T05]  (hidden comment: ERJ-2GE0R00X)
R150  Resistance: 1.65 KOhm  [RESC1005X40X25LL05T05]  (hidden comment: ERJ-2RKF1651X)
R151  Resistance: 10 KOhm  [RESC1005X40X25NL05T05]  (hidden comment: ERJ-2RKF1002X)
R152  Resistance: 17.8 KOhm  [RESC1005X40X25LL05T05]  (hidden comment: ERJ-2RKF1782X)
R153  Resistance: 1.65 KOhm  [RESC1005X40X25LL05T05]  (hidden comment: ERJ-2RKF1651X)
R154  Resistance: 1.65 KOhm  [RESC1005X40X25LL05T05]  (hidden comment: ERJ-2RKF1651X)
U10#1  LTM4677IY#PBF  [LT-BGA-144-05-08-1920_V]  (part A of 2)
U10#2  LTM4677IY#PBF  [LT-BGA-144-05-08-1920_V]  (part B of 2)

### Ports
PMbus_ALTERTn (bidir), PMbus_SCL_3V3 (bidir), PMbus_SDA_3V3 (bidir)

### Nets
A10_0V9: C80.1 C81.1 C82.2 C83.2 C84.2 C87.1 C88.1 C89.2 C90.2 C91.2 C92.2 C93.2 U10#1.A1(VOUT0) U10#1.A2(VOUT0) U10#1.A3(VOUT0) U10#1.B1(VOUT0) U10#1.B2(VOUT0) U10#1.B3(VOUT0) U10#1.C1(VOUT0) U10#1.C2(VOUT0) U10#1.C3(VOUT0) U10#1.D1(VOUT0) U10#1.D2(VOUT0) U10#1.D3(VOUT0) U10#1.J1(VOUT1) U10#1.J2(VOUT1) U10#1.J3(VOUT1) U10#1.K1(VOUT1) U10#1.K2(VOUT1) U10#1.K3(VOUT1) U10#1.L1(VOUT1) U10#1.L2(VOUT1) U10#1.L3(VOUT1) U10#1.M1(VOUT1) U10#1.M2(VOUT1) U10#1.M3(VOUT1)
A10_12V: C85.2 C86.2 R141.2 U10#1.A11(VIN0) U10#1.A12(VIN0) U10#1.B11(VIN0) U10#1.B12(VIN0) U10#1.C11(VIN0) U10#1.C12(VIN0) U10#1.D11(VIN0) U10#1.D12(VIN0) U10#1.E12(VIN0) U10#1.H12(VIN1) U10#1.J11(VIN1) U10#1.J12(VIN1) U10#1.K11(VIN1) U10#1.K12(VIN1) U10#1.L11(VIN1) U10#1.L12(VIN1) U10#1.M11(VIN1) U10#1.M12(VIN1)
A10_GNDSENSE: R143.2
A10_VCCLSENSE: R142.2
GND: C80.2 C81.2 C82.1 C83.1 C84.1 C85.1 C86.1 C87.2 C88.2 C89.1 C90.1 C91.1 C92.1 C93.1 L8.1 U10#2.A4(GND) U10#2.A6(GND) U10#2.A7(GND) U10#2.A8(GND) U10#2.A9(GND) U10#2.A10(GND) U10#2.B4(GND) U10#2.B5(GND) U10#2.B6(GND) U10#2.B7(GND) U10#2.B8(GND) U10#2.B9(GND) U10#2.C4(GND) U10#2.C6(GND) U10#2.C7(GND) U10#2.C8(GND) U10#2.C9(GND) U10#2.D4(GND) U10#2.D7(GND) U10#2.E3(GND) U10#2.F3(GND) U10#2.F10(GND) U10#2.G3(GND) U10#2.G10(GND) U10#2.G11(GND) U10#2.G12(GND) U10#2.H3(GND) U10#2.H10(GND) U10#2.J4(GND) U10#2.J10(GND) U10#2.K4(GND) U10#2.K7(GND) U10#2.K8(GND) U10#2.K9(GND) U10#2.L4(GND) U10#2.L5(GND) U10#2.L6(GND) U10#2.L7(GND) U10#2.L8(GND) U10#2.L9(GND) U10#2.M4(GND) U10#2.M6(GND) U10#2.M7(GND) U10#2.M8(GND) U10#2.M9(GND) U10#2.M10(GND)
GND_SIGNAL1: L8.2 R150.1 R151.2 R152.1 R153.2 R154.2 U10#2.F7(SGND) U10#2.F8(SGND) U10#2.G7(SGND) U10#2.G8(SGND)
PMbus_ALTERTn: U10#1.E5(~{ALERT}) ; port PMbus_ALTERTn
PMbus_SCL_3V3: U10#1.E6(SCL) ; port PMbus_SCL_3V3
PMbus_SDA_3V3: U10#1.D6(SDA) ; port PMbus_SDA_3V3
0.9VO_SENSE+: R142.1 U10#1.D9(VOSNS0+)  [also labelled VOSNS1]
0.9VO_SENSE-: R143.1 U10#1.E9(VOSNS0-)
COMP01: C94.2 U10#1.E8(COMP0a) U10#1.H8(COMP1a)
SENSESYNC_  1: R147.1 U10#1.E7(SYNC)
SHARE_CLK1: R148.1 U10#1.H7(SHARE_CLK)
VDD33_1: R147.2 R148.2 U10#2.J7(VDD33)
NetC94_1: C94.1 R152.2
NetR141_1: R141.1 U10#1.F11(SVIN) U10#1.F12(SVIN)
NetR149_1: R149.1 U10#1.J5(TSNS1a)
NetR149_2: R149.2 U10#1.K5(TSNS1b)
NetR150_2: R150.2 U10#1.G4(ASEL)
NetR151_1: R151.1 U10#1.K6(WP)
NetR153_1: R153.1 U10#1.G5(VOUT0CFG)
NetR154_1: R154.1 U10#1.G6(VOUT1CFG)
NetU10#1_C5: U10#1.C5(TSNS0b) U10#1.D5(TSNS0a)
NetU10#1_E1: U10#1.E1(ISNS0b-) U10#1.E2(ISNS0a-)
NetU10#1_F1: U10#1.F1(ISNS0b+) U10#1.F2(ISNS0a+)
NetU10#1_G1: U10#1.G1(ISNS1b-) U10#1.G2(ISNS1a-)
NetU10#1_H1: U10#1.H1(ISNS1b+) U10#1.H2(ISNS1a+)

Not connected (* = marked no-connect by the designer): U10#1 A5(SNUB0) B10(SW0) C10(DNC) D8(COMP0b) D10(VORB0+) E4(~{GPIO}0) E10(VORB0-) E11(DNC) F4(~{GPIO}1) F5(RUN0) F6(RUN1) H4(FSWPHCFG) H5(VTRIM0CFG) H6(VTRIM1CFG) H9(VOSNS1) H11(DNC) J8(COMP1b) J9(VORB1) K10(DNC) L10(SW1) M5(SNUB1); U10#2 F9(INTVCC) G9(INTVCC) J6(VDD25)

### Notes on the sheet
- I max= 4.5A
- I max= 30A
- Title
- Size:
- Date:
- B
- Number:
- Time:
- Revision:
- Sheet
- of
- File:

### Library data of the parts
C80 C81 C87 C88 = CMP-1665-00019-2: Tantalum Capacitor, 330 uF, +/- 20%, 6.3 V, -55 to 105 degC, 2-Pin Molded, RoHS, Tape and Reel; ComponentLink2Description: Datasheet; Radiation Hardening: No; ComponentLink1URL: http://www.panasonic.com/; Min Operating Temperature: -55 degC; Mounting Technology: Surface Mount; Mount: Surface Mount; ComponentLink2URL: http://industrial.panasonic.com/cdbs/www-data/pdf/AAA8000/AAA8000C38.pdf; Case/Package: 2917; ComponentLink3Description: Package Specification; PackageDescription: 2-Pin Molded Capacitor, Body 7.3 x 4.3 mm; Width: 0.169 inch; DatasheetVersion: 11/2015; Length: 0.287 inch; ComponentLink3URL: http://industrial.panasonic.com/cdbs/www-data/pdf/AAA8000/AAA8000COL34.pdf; Height: 2.8 mm; RoHSCompliant: True; ComponentLink1Description: Manufacturer URL; REACH SVHC: Unknown; Package Quantity: 2500; Max Operating Temperature: 105 degC; Packaging: Tape and Reel; PartNumber: 6TPF330M9L
C82-C84 C89-C93 = CMP-1662-00011-2: as C509 on sheet PCIE_Connector; Tolerance: 20%; ComponentLink1URL: http://www.murata.com/; ComponentLink1Description: Manufacturer URL; PackageDescription: 2-Pin Surface Mount Device, Body 3.2 x 1.6 mm; Max Operating Temperature: 85 degC; Case Code (Imperial): 1206; PackageReference: 1206; Height: 1.6 mm; Width: 1.6 mm; Packaging: Tape and Reel; DatasheetVersion: 09/2016; REACH SVHC: No SVHC; Mounting Technology: Surface Mount; Case Code (Metric): 3216; Min Operating Temperature: -55 degC; RoHSCompliant: true; Radiation Hardening: No; Voltage Rating (DC): 6.3 V; Package Quantity: 2000; ComponentLink2Description: Datasheet; Mount: Surface Mount; Length: 3.2 mm; ComponentLink2URL: http://psearch.en.murata.com/capacitor/product/GRM31CR60J107ME39%23.pdf; Pins: 2; PartNumber: GRM31CR60J107ME39L
C85 C86 = CMP-1662-00010-2: as C500 on sheet PCIE_Connector; Tolerance: 10%; Max Operating Temperature: 85 degC; Package Quantity: 2000; Voltage Rating: 25 V; Case Code (Metric): 3216; Length: 3.2 mm; PackageDescription: 2-Pin Surface Mount Device, Body 3.2 x 1.6 mm; ComponentLink1Description: Manufacturer URL; Case Code (Imperial): 1206; ComponentLink1URL: http://www.murata.com/; Radiation Hardening: No; Height: 1.6 mm; Width: 1.6 mm; DatasheetVersion: 03/2016; Min Operating Temperature: -55 degC; Mount: Surface Mount; REACH SVHC: No SVHC; PackageReference: 1206; ComponentLink2URL: http://search.murata.co.jp/Ceramy/image/img/A01X/G101/ENG/GRM31CR61E226KE15-01.pdf; Packaging: Tape and Reel; RoHSCompliant: true; ComponentLink2Description: Datasheet; Mounting Technology: Surface Mount; PartNumber: GRM31CR61E226KE15L; Pins: 2
C94 = CMP-1666-00016-3: Chip Capacitor, 1.8 nF, +/- 5%, 16 V, -55 to 125 degC, 0402 (1005 Metric), RoHS, Tape and Reel; Voltage Rating (DC): 16 V; Case\/Package: 0402; Type (Capacitors): X7R; Tolerance: 5%; RoHSCompliant: true; ComponentLink1URL: http://www.vishay.com/; Max Operating Temperature: 125 degC; PackageDescription: 2-Pin Surface Mount Device, Body 1 x 0.5 mm; ComponentLink1Description: Manufacturer URL; Case Code (Imperial): 0402; Length: 1 mm; Min Operating Temperature: -55 degC; Mounting Technology: Surface Mount; ComponentLink2Description: Datasheet; Width: 0.5 mm; Packaging: Tape and Reel; Case Code (Metric): 1005; Height: 0.5 mm; PartNumber: VJ0402Y182JXJCW1BC; Package Quantity: 10000; ComponentLink2URL: http://www.vishay.com/docs/28548/vjw1bcbascomseries.pdf; DatasheetVersion: 07/2016; Mount: Surface Mount; Pins: 2; Voltage Rating: 16 V; PackageReference: 0402
L8 = CMP-0220-00193-1: SMD EMI Suppression Ferrite Bead WE-CBF, Z = 30 Ohm; Impedance: 30 Ohm; ComponentLink2URL: http://www.we-online.de/katalog/media/pdf/742792609.pdf; ComponentLink1URL: http://www.we-online.com; ComponentLink2Description: Datasheet; PackageDescription: Chip Inductor, 2-Leads, Body 1.6 x 0.8 mm; ComponentLink1Description: Manufacturer Link; PackageReference: SMD-0603; DatasheetVersion: Dec-2005; PackageVersion: 2009
R141-R143 R149 = CMP-2002-00429-3: as R335-R338 on sheet PLL; Max Operating Temperature: 155 degC; Tolerance: 5%; PartNumber: ERJ-2GE0R00X; Case Code (Imperial): 0402; Package Quantity: 10000; Length: 1 mm; Mounting Technology: Surface Mount; ComponentLink1URL: http://www.panasonic.com/; Height: 0.35 mm; Width: 0.5 mm; Min Operating Temperature: -55 degC; Case Code (Metric): 1005; RoHSCompliant: true; REACH SVHC: Unknown; ComponentLink1Description: Manufacturer URL; Packaging: Tape and Reel; Mount: Surface Mount; PackageDescription: 2-Pin Surface Mount Device, Body 1 x 0.5 mm; PackageReference: 0402; ComponentLink2URL: http://industrial.panasonic.com/cdbs/www-data/pdf/RDA0000/AOA0000C84.pdf; DatasheetVersion: 03/2015; Radiation Hardening: No; Pins: 2; ComponentLink2Description: Datasheet
R147 R148 R151 = CMP-2002-00607-3: as R140 on sheet 12V_POWER; Case Code (Imperial): 0402; Min Operating Temperature: -55 degC; PartNumber: ERJ-2RKF1002X; Mounting Technology: Surface Mount; Length: 1 mm; Packaging: Tape and Reel; ComponentLink1Description: Manufacturer URL; Mount: Surface Mount; Package Quantity: 10000; Max Operating Temperature: 155 degC; Case Code (Metric): 1005; Height: 0.35 mm; ComponentLink1URL: http://www.panasonic.com/; Tolerance: 1%; REACH SVHC: Yes; RoHSCompliant: true; Width: 0.5 mm; PackageDescription: 2-Pin Surface Mount Device, Body 1 x 0.5 mm; Radiation Hardening: No; PackageReference: 0402; ComponentLink2Description: Datasheet; DatasheetVersion: 04/2015; ComponentLink2URL: http://industrial.panasonic.com/cdbs/www-data/pdf/RDA0000/AOA0000C86.pdf; Pins: 2
R150 R153 R154 = CMP-2002-00716-3: Chip Resistor, 1.65 KOhm, +/- 1%, 100 mW, -55 to 155 degC, 0402 (1005 Metric), RoHS, Tape and Reel; Manufacturer: Basic Passives; Voltage Rating: 50 V; Power Rating: 100 mW; Case\/Package: 0402; Tolerance: 1%; ComponentLink1URL: http://www.panasonic.com/; RoHSCompliant: true; Package Quantity: 10000; REACH SVHC: Yes; Packaging: Tape and Reel; Mount: Surface Mount; PartNumber: ERJ-2RKF1651X; Case Code (Imperial): 0402; Height: 0.35 mm; Min Operating Temperature: -55 degC; ComponentLink1Description: Manufacturer URL; Mounting Technology: Surface Mount; Width: 0.5 mm; PackageDescription: 2-Pin Surface Mount Device, Body 1 x 0.5 mm; Max Operating Temperature: 155 degC; Case Code (Metric): 1005; Length: 1 mm; PackageReference: 0402; DatasheetVersion: 04/2015; ComponentLink2URL: http://industrial.panasonic.com/cdbs/www-data/pdf/RDA0000/AOA0000C86.pdf; ComponentLink2Description: Datasheet; Pins: 2
R152 = CMP-2002-00732-3: Chip Resistor, 17.8 KOhm, +/- 1%, 100 mW, -55 to 155 degC, 0402 (1005 Metric), RoHS, Tape and Reel; Manufacturer: Basic Passives; Power Rating: 100 mW; Voltage Rating: 50 V; Case\/Package: 0402; Package Quantity: 10000; ComponentLink1URL: http://www.panasonic.com/; PackageDescription: 2-Pin Surface Mount Device, Body 1 x 0.5 mm; Packaging: Tape and Reel; Case Code (Metric): 1005; Tolerance: 1%; ComponentLink1Description: Manufacturer URL; Mount: Surface Mount; RoHSCompliant: true; REACH SVHC: Unknown; Height: 0.35 mm; Case Code (Imperial): 0402; PartNumber: ERJ-2RKF1782X; Min Operating Temperature: -55 degC; Max Operating Temperature: 155 degC; Length: 1 mm; Mounting Technology: Surface Mount; Width: 0.5 mm; DatasheetVersion: 04/2015; ComponentLink2Description: Datasheet; Pins: 2; ComponentLink2URL: http://industrial.panasonic.com/cdbs/www-data/pdf/RDA0000/AOA0000C86.pdf; PackageReference: 0402
U10#1 U10#2 = CMP-1701-00001-1: Dual 18 A or Single 36 A uModule Regulator with Digital Power System Management, 4.5 to 16 V Input, 0.5 to 1.8 V Output, -40 to 125 degC, 144-Ball BGA, RoHS, Tray; Manufacturer: Linear Technology; ComponentLink1Description: Manufacturer URL; PartNumber: LTM4677IY#PBF; PackageVersion: Rev. B, 02/2013; ComponentLink3URL: http://www.linear.com/docs/41077; ComponentLink2URL: http://cds.linear.com/docs/en/datasheet/4677f.pdf; ComponentLink1URL: http://www.linear.com/; Mounting Technology: Surface Mount; ComponentLink2Description: Datasheet; PackageReference: BGA-144; PackageDescription: 144-Ball Ball Grid Array, Body 16 x 16 mm, Pitch 1.27 mm; ComponentLink3Description: Package Specification; DatasheetVersion: Rev. F; PartId: 1